# Altium schematic sheet eFuse_Slave_Supply.SchDoc
size A4
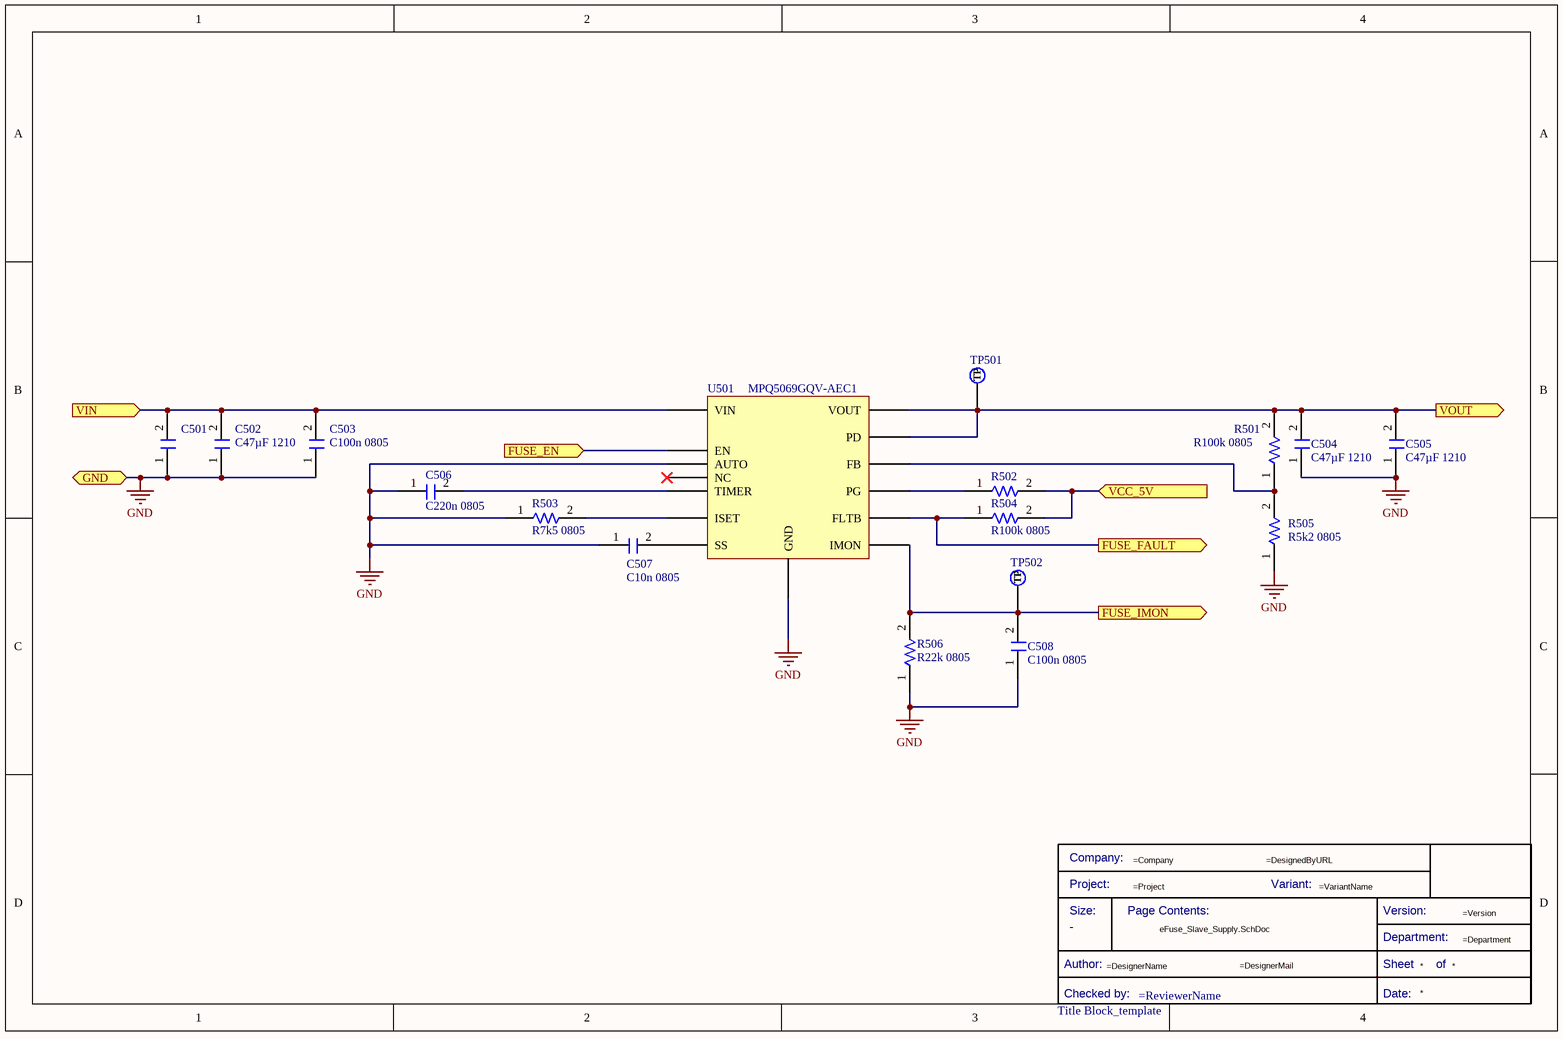
[diagram p0: eFuse_Slave_Supply.SchDoc]

## Parts
*  Title Block_template  (graphical)
C501  C47µF-10V-1210  [FP-GRM32E-0_3-0_2-IPC_C]  (value not drawn)
C502  C47µF 1210  [FP-GRM32E-0_3-0_2-IPC_C]
C503  C100n 0805  [C0805FNPC-R]
C504  C47µF 1210  [FP-GRM32E-0_3-0_2-IPC_C]
C505  C47µF 1210  [FP-GRM32E-0_3-0_2-IPC_C]
C506  C220n 0805  [C0805FNPC-W]
C507  C10n 0805  [C0805FNPC-R]
C508  C100n 0805  [C0805FNPC-R]
R501  R100k 0805  [RESC2013X70X40NL20T20]
R502  R100k 0805  [RESC2013X70X40NL20T20]  (value not drawn)
R503  R7k5 0805  [RESC2013X50X30ML20T20]
R504  R100k 0805  [RESC2013X70X40NL20T20]
R505  R5k2 0805  [RESC2013X70X40NL20T20]
R506  R22k 0805  [RESC2013X70X40NL20T20]
TP501  TestPoint  [TestPoint]  (value not drawn)  (no BOM)
TP502  TestPoint  [TestPoint]  (value not drawn)  (no BOM)
U501  MPQ5069GQV-AEC1  [QFN127P600-8N]

## Ports
FUSE_EN (in), FUSE_FAULT (out), FUSE_IMON (out), GND (bidir), VCC_5V (in), VIN (in), VOUT (out)

## Nets
GND: C501.1 C502.1 C503.1 C504.1 C505.1 C506.1 C507.1 C508.1 R503.1 R505.1 R506.1 U501.3(AUTO) U501.8(GND) ; port GND
FUSE_EN: U501.2(EN) ; port FUSE_EN
FUSE_FAULT: R504.1 U501.10(FLTB) ; port FUSE_FAULT
FUSE_IMON: C508.2 R506.2 TP502.1(TP) U501.9(IMON) ; port FUSE_IMON
VCC_5V: R502.2 R504.2 ; port VCC_5V
VIN: C501.2 C502.2 C503.2 U501.1(VIN) ; port VIN
VOUT: C504.2 C505.2 R501.2 TP501.1(TP) U501.13(PD) U501.14(VOUT) ; port VOUT
NetC506_2: C506.2 U501.5(TIMER)
NetC507_2: C507.2 U501.7(SS)
NetR501_1: R501.1 R505.2 U501.12(FB)
NetR502_1: R502.1 U501.11(PG)
NetR503_2: R503.2 U501.6(ISET)

Not connected (* = marked no-connect by the designer): U501 4(NC)*

## Notes on the sheet
- (in symbol CMP-00043-2) Company:; Project:; Variant:; Size:; Page Contents:; Version:; Department:; Author:; Sheet; of; Checked by:; Date:

## Library data of the parts
* = CMP-00043-2: Standard Title Block; .Creator: GP; Checked by:: =ReviewerName; Size: -; Design Item ID: Title Block_template; Category: Title Block; .PCBcheck: GP; Source: e-Tech_Racing.SchLib; .SCHcheck: GP
C501 C502 C504 C505 = CMP-001-00003-2: Ceramic Capacitor, Multilayer, Ceramic, 10V, 10% +Tol, 10% -Tol, X6S, 22% TC, 47uF, Surface Mount, 1210; Value: 47µF; Case/Package: 1210; RoHS Compliant: Yes; Min Operating Temperature: -55°C; Capacitor Type: Ceramic; Max Operating Temperature: 105°C; Mounting Technology: Surface Mount; Pins: 2
C503 C508 = CMP-00063-1: Cap, 0.1ΜF, 50V, 10%, X7R, 0805; Manufacturer 1: Wurth Electronics; Manufacturer Part Number 1: 885012207098; Value: 100nF; .Creator: DR; Pricing 1: 100=0,10200, 500=0,07100, 2000=0,06100 (GBP); ComponentLink1URL: http://www.farnell.com/datasheets/1958498.pdf?src-supplier=Farnell; Design Item ID: C100n-50V-0805FNPC-X7R; Voltage Rating (DC): 50V; Voltage Rating: 50V; Max Operating Temperature: 125°C; RoHS: Yes; Case Code (Metric): 2012; Mount: Surface Mount; REACH SVHC: Unknown; Stock 1: 8000; Source: Passives.SchLib; Tolerance: 10%; RoHS Compliant: Yes; Dielectric: X7R; ComponentLink2Description: http://www.farnell.com/datasheets/1958498.pdf?src-supplier=Element14; ComponentLink2URL: http://www.farnell.com/datasheets/1958498.pdf?src-supplier=Element14; Min Operating Temperature: -55°C; Width: 0.049inch; Category: Ceramic Capacitors; Thickness: 0.035inch; Length: 0.079inch; ComponentLink3URL: https://katalog.we-online.de/pbs/datasheet/885012207098.pdf?src-supplier=Digi-Key; Case/Package: 0805; ComponentLink3Description: https://katalog.we-online.de/pbs/datasheet/885012207098.pdf?src-supplier=Digi-Key; Packaging: Cut Tape; ComponentLink1Description: http://www.farnell.com/datasheets/1958498.pdf?src-supplier=Farnell; ComponentLink4Description: http://www.farnell.com/datasheets/1958498.pdf?src-supplier=Newark; ComponentLink4URL: http://www.farnell.com/datasheets/1958498.pdf?src-supplier=Newark
C506 = CMP-00048-1: Cap Ceramic 0.22uF 50V X5R 10% Pad SMD 0805 85C Low ESR Automotive T/R; Manufacturer: Taiyo Yuden; Manufacturer Part Number: UMK212BJ224KGHT; .Creator: DR; Value: 220nF; ComponentLink2URL: https://eu.mouser.com/ProductDetail/Taiyo-Yuden/UMK212BJ224KGHT?qs=CNQs48zzdnpf%2FbZJTfp33Q%3D%3D; Design Item ID: C0.22u-0805FNPC-X5R; RoHS Compliant: Yes; Min Operating Temperature: -55°C; ComponentLink2Description: Where buy it; Thickness: 0.053inch; Tolerance: 10%; Termination: SMD/SMT; Stock 1: 900; Length: 0.079inch; RoHS: Yes; Voltage Rating (DC): 50V; Lead Free: Lead Free; Source: Passives.SchLib; Mount: Surface Mount; Halogen Free: Halogen Free; Width: 0.049inch; Ratings: AEC-Q200; Case/Package: 0805; ComponentLink1Description: Datasheet; Dielectric: X5R; Max Operating Temperature: 85°C; Package Quantity: 3000; Case Code (Metric): 2012; ComponentLink1URL: https://eu.mouser.com/datasheet/2/396/taiyo_yuden_12132018_mlcc11_hq_e-1510082.pdf; Voltage Rating: 50V; Pricing 1: 1=0,20000, 10=0,13700, 50=0,08220, 100=0,06950, 500=0,04754, 1000=0,04206 (USD); Category: Capacitor; Packaging: Tape and Reel; Height: 1.25mm
C507 = CMP-00053-1: Cap, 0.01ΜF, 50V, 10%, X7R, 0805; Manufacturer Part Number 1: 885012207092; Manufacturer 1: Wurth Electronics; .Creator: DR; Value: 10nF; ComponentLink4URL: https://katalog.we-online.de/pbs/datasheet/885012207092.pdf?src-supplier=Digi-Key; Width: 0.049inch; ComponentLink1URL: http://www.farnell.com/datasheets/1958497.pdf?src-supplier=Farnell; Max Operating Temperature: 125°C; Packaging: Cut Tape; Mount: Surface Mount; ComponentLink2Description: http://www.farnell.com/datasheets/1958497.pdf?src-supplier=Element14; Voltage Rating: 50V; Source: Passives.SchLib; Design Item ID: C10n-50V-0805FNPC-X7R; ComponentLink4Description: https://katalog.we-online.de/pbs/datasheet/885012207092.pdf?src-supplier=Digi-Key; Stock 1: 1; Tolerance: 10%; REACH SVHC: Unknown; ComponentLink2URL: http://www.farnell.com/datasheets/1958497.pdf?src-supplier=Element14; ComponentLink1Description: http://www.farnell.com/datasheets/1958497.pdf?src-supplier=Farnell; RoHS: Yes; Min Operating Temperature: -55°C; Voltage Rating (DC): 50V; Dielectric: X7R; ComponentLink3URL: http://www.farnell.com/datasheets/1958497.pdf?src-supplier=Newark; Category: Ceramic Capacitors; ComponentLink3Description: http://www.farnell.com/datasheets/1958497.pdf?src-supplier=Newark; Case/Package: 0805; Pricing 1: 4000=0,03200, 12000=0,03100 (USD); Length: 0.079inch; RoHS Compliant: Yes; Case Code (Metric): 2012; Thickness: 0.035inch
R501 R502 R504-R506 = CMP-009-00003-2: Fixed Resistor, Metal Glaze/thick Film, 0.125W, 100000ohm, 150V, 5% +/-Tol, 200ppm/Cel, Surface Mount, 0805; Value: 100k; Power: 125mW; Max Operating Temperature: 155°C; Mounting Technology: Surface Mount; RoHS Compliant: Yes; Min Operating Temperature: -55°C; Pins: 2; Case/Package: 0805; Tolerance: 5%
R503 = CMP-009-00005-1: Fixed Resistor, Metal Glaze/thick Film, 0.125W, 15000ohm, 150V, 1% +/-Tol, 100ppm/Cel, Surface Mount, 0805; Value: 15k; Power: 125mW; Min Operating Temperature: -55°C; Mounting Technology: Surface Mount; RoHS Compliant: No; Tolerance: 1%; Pins: 2; Max Operating Temperature: 155°C; Case/Package: 0805
TP501 TP502 = CMP-00042-1: Test Point 1x1 mm; .SCHcheck: GP; Category: TestPoint; Source: e-Tech_Racing.SchLib; .Creator: GP; .PCBcheck: GP; Design Item ID: TestPoint
U501 = CMP-019-00005-1: 7mΩ Protection Switch with Current Monitor for Automotive Battery Systems AEC-Q100 Qualified; pin to pad: 1>21+22+23+24+25 2>1 3>2 4>3 5>4 6>5 7>6 8>7 9>8 10>9 11>10 12>11 13>12 14>13+14+15+16+17+18+19+20